# EAGLE schematic rot-brace (EAGLE 6.3)
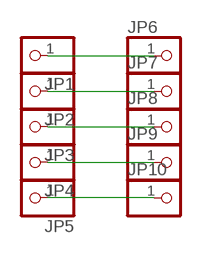
[diagram p0: schematic, sheet 1]

## Parts
JP1  HEADER-1X1ROUND  [1X01_ROUND]
JP2  HEADER-1X1ROUND  [1X01_ROUND]
JP3  HEADER-1X1ROUND  [1X01_ROUND]
JP4  HEADER-1X1ROUND  [1X01_ROUND]
JP5  HEADER-1X1ROUND  [1X01_ROUND]
JP6  HEADER-1X1ROUND  [1X01_ROUND]
JP7  HEADER-1X1ROUND  [1X01_ROUND]
JP8  HEADER-1X1ROUND  [1X01_ROUND]
JP9  HEADER-1X1ROUND  [1X01_ROUND]
JP10  HEADER-1X1ROUND  [1X01_ROUND]

## Nets
N$1: JP5.1 JP10.1
N$2: JP4.1 JP9.1
N$3: JP3.1 JP8.1
N$4: JP2.1 JP7.1
N$5: JP1.1 JP6.1

## Library data of the parts
JP1-JP10 = microbuilder:HEADER-1X1: PIN HEADER